# EasyEDA schematic LcsNodes-Building-Block-Track-Sensor-2x4-Way.json
TITLE: LcsNodes - Track Sensor (2x4Way); REV: 1.0; Date: 2022-09-29; Sheet: 1/1; Drawn By: helmut-f; Company: Your Company
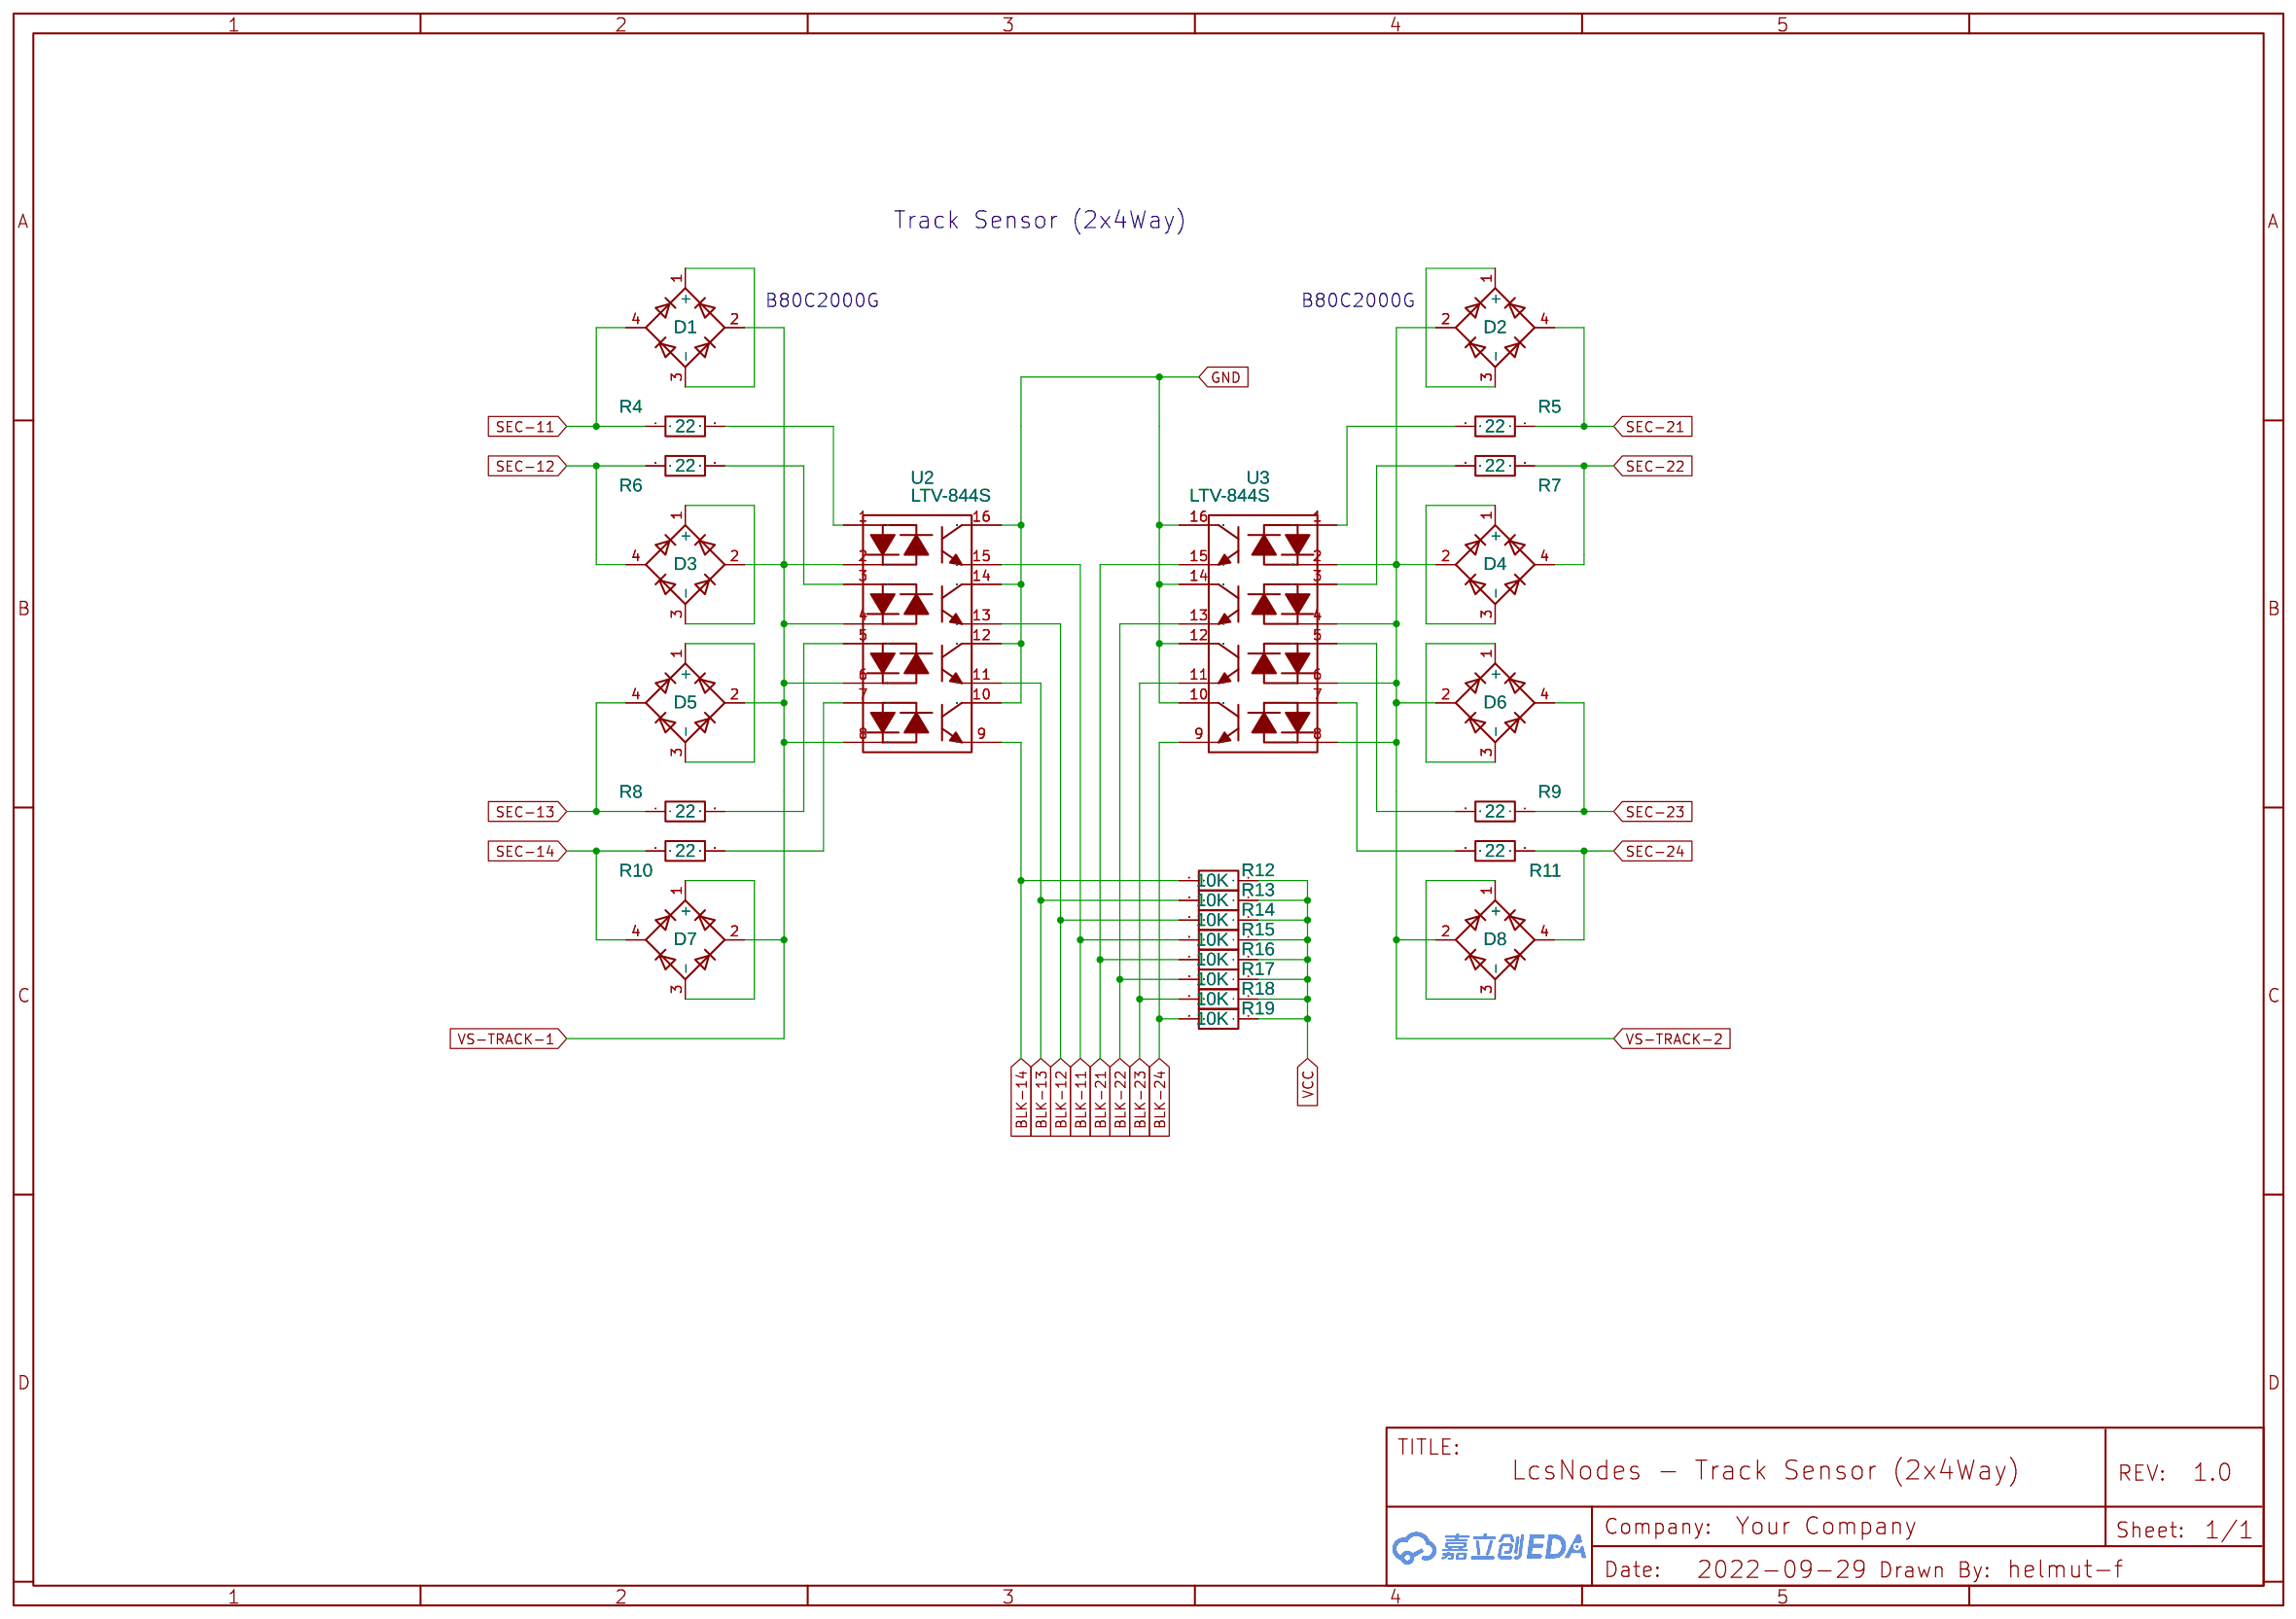
[diagram p0: schematic sheet]

## Parts
D1  B80C2000G GLEICHRICHTER RUND  [DIODE_BRIDGE_ROUND_D9.8MM]
D2  B80C2000G GLEICHRICHTER RUND  [DIODE_BRIDGE_ROUND_D9.8MM]
D3  B80C2000G GLEICHRICHTER RUND  [DIODE_BRIDGE_ROUND_D9.8MM]
D4  B80C2000G GLEICHRICHTER RUND  [DIODE_BRIDGE_ROUND_D9.8MM]
D5  B80C2000G GLEICHRICHTER RUND  [DIODE_BRIDGE_ROUND_D9.8MM]
D6  B80C2000G GLEICHRICHTER RUND  [DIODE_BRIDGE_ROUND_D9.8MM]
D7  B80C2000G GLEICHRICHTER RUND  [DIODE_BRIDGE_ROUND_D9.8MM]
D8  B80C2000G GLEICHRICHTER RUND  [DIODE_BRIDGE_ROUND_D9.8MM]
R4  22  [R1206]
R5  22  [R1206]
R6  22  [R1206]
R7  22  [R1206]
R8  22  [R1206]
R9  22  [R1206]
R10  22  [R1206]
R11  22  [R1206]
R12  10K  [R1206]
R13  10K  [R1206]
R14  10K  [R1206]
R15  10K  [R1206]
R16  10K  [R1206]
R17  10K  [R1206]
R18  10K  [R1206]
R19  10K  [R1206]
U2  LTV-844S  [OPTO-SMD-16_L19.8-W6.5-P2.54-LS10.2-BL]
U3  LTV-844S  [OPTO-SMD-16_L19.8-W6.5-P2.54-LS10.2-BL]

## Library data of the parts
D1-D8 = B80C1500G GLEICHRICHTER RUND: Contributor: mastad
R4-R19 = R_AXIAL-0.3_EU: Contributor: LCEDA_Lib
U2 U3 = LTV-844S: Supplier: LCSC; Supplier Part: C575506; Manufacturer: LITEON(台湾光宝); JLCPCB Part Class: Extended Part; Contributor: LCSC

## Nets
GND: U2.10 U2.12 U2.14 U2.16 U3.10 U3.12 U3.14 U3.16
VCC: R12.1 R13.1 R14.1 R15.1 R16.1 R17.1 R18.1 R19.1
BLK-11: R15.2 U2.15
BLK-12: R14.2 U2.13
BLK-13: R13.2 U2.11
BLK-14: R12.2 U2.9
BLK-21: R16.2 U3.15
BLK-22: R17.2 U3.13
BLK-23: R18.2 U3.11
BLK-24: R19.2 U3.9
SEC-11: D1.4 R4.1
SEC-12: D3.4 R6.1
SEC-13: D5.4 R8.1
SEC-14: D7.4 R10.1
SEC-21: D2.4 R5.1
SEC-22: D4.4 R7.1
SEC-23: D6.4 R9.1
SEC-24: D8.4 R11.1
VS-TRACK-1: D1.2 D3.2 D5.2 D7.2 U2.2 U2.4 U2.6 U2.8
VS-TRACK-2: D2.2 D4.2 D6.2 D8.2 U3.2 U3.4 U3.6 U3.8
Net-(D1-1): D1.1(+) D1.3(-)
Net-(D2-1): D2.1(+) D2.3(-)
Net-(D3-1): D3.1(+) D3.3(-)
Net-(D4-1): D4.1(+) D4.3(-)
Net-(D5-1): D5.1(+) D5.3(-)
Net-(D6-1): D6.1(+) D6.3(-)
Net-(D7-1): D7.1(+) D7.3(-)
Net-(D8-1): D8.1(+) D8.3(-)
Net-(R4-2): R4.2 U2.1
Net-(R5-2): R5.2 U3.1
Net-(R6-2): R6.2 U2.3
Net-(R7-2): R7.2 U3.3
Net-(R8-2): R8.2 U2.5
Net-(R9-2): R9.2 U3.5
Net-(R10-2): R10.2 U2.7
Net-(R11-2): R11.2 U3.7

## Notes on the sheet
- Track Sensor (2x4Way)
- B80C2000G
- B80C2000G
